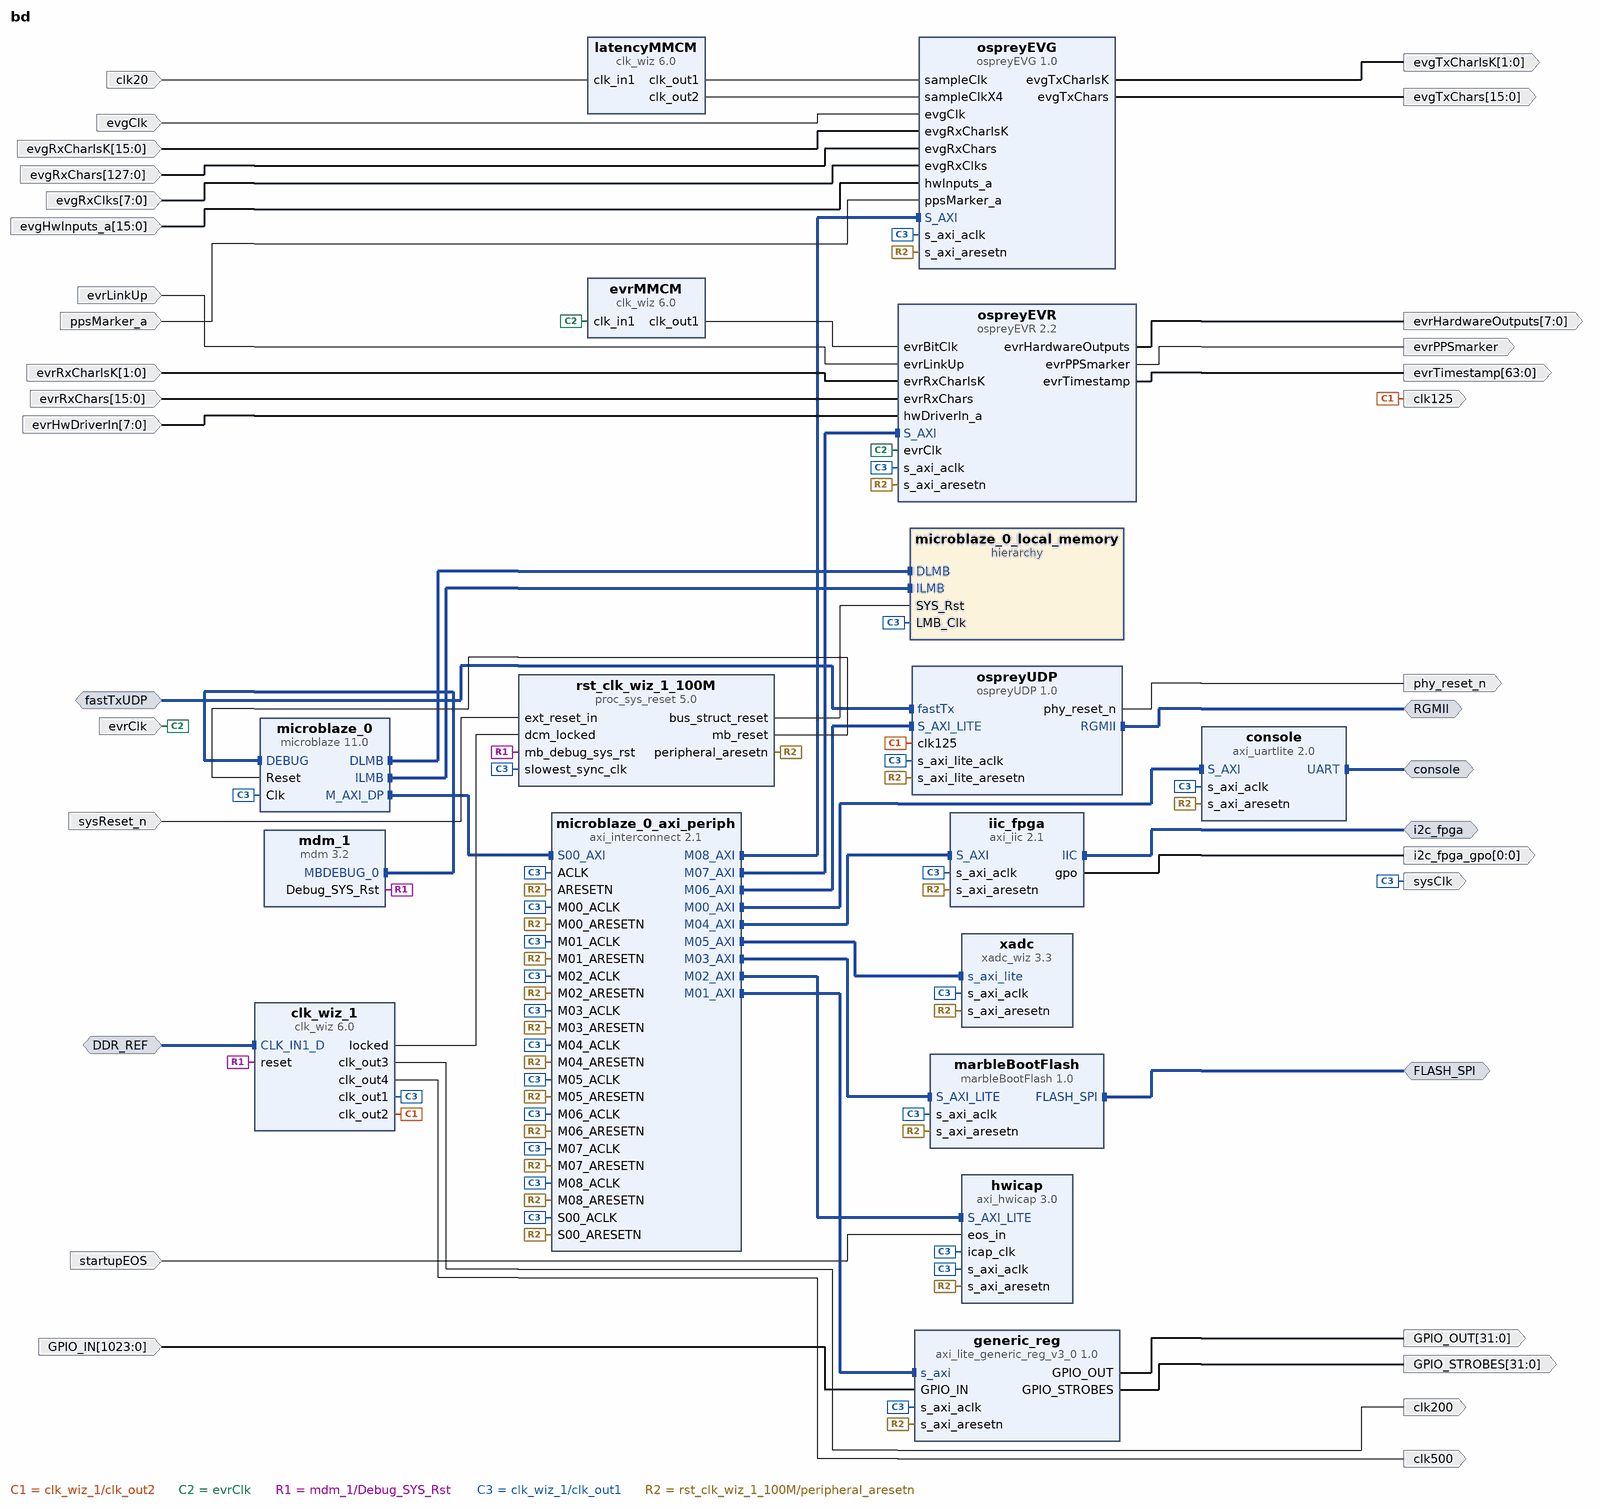
[diagram p0: block diagram of the top level]
# Vivado block design bd, xc7k160tffg676-2, Vivado 2023.1
create_bd_design bd

create_bd_intf_port -mode Slave -vlnv xilinx.com:interface:diff_clock_rtl:1.0 DDR_REF
set_property -dict {CONFIG.FREQ_HZ 125000000} [get_bd_intf_ports DDR_REF]
create_bd_intf_port -mode Master -vlnv xilinx.com:interface:uart_rtl:1.0 console
create_bd_intf_port -mode Master -vlnv OspreyDCS:user:FLASH_SPI_rtl:1.1 FLASH_SPI
create_bd_intf_port -mode Master -vlnv xilinx.com:interface:iic_rtl:1.0 i2c_fpga
create_bd_intf_port -mode Master -vlnv xilinx.com:interface:rgmii_rtl:1.0 RGMII
create_bd_intf_port -mode Slave -vlnv xilinx.com:interface:axis_rtl:1.0 fastTxUDP
set_property -dict [list \
  CONFIG.FREQ_HZ 125000000 \
  CONFIG.HAS_TKEEP 0 \
  CONFIG.HAS_TLAST 1 \
  CONFIG.HAS_TREADY 1 \
  CONFIG.HAS_TSTRB 0 \
  CONFIG.LAYERED_METADATA undef \
  CONFIG.TDATA_NUM_BYTES 1 \
  CONFIG.TDEST_WIDTH 0 \
  CONFIG.TID_WIDTH 0 \
  CONFIG.TUSER_WIDTH 0 \
] [get_bd_intf_ports fastTxUDP]
create_bd_port -dir I -type rst sysReset_n
set_property -dict {CONFIG.POLARITY ACTIVE_LOW} [get_bd_ports sysReset_n]
create_bd_port -dir I -from 1023 -to 0 GPIO_IN
create_bd_port -dir O -from 31 -to 0 GPIO_OUT
create_bd_port -dir O -from 31 -to 0 GPIO_STROBES
create_bd_port -dir O -type clk sysClk
create_bd_port -dir O -from 0 -to 0 i2c_fpga_gpo
create_bd_port -dir O phy_reset_n
create_bd_port -dir I evgClk
create_bd_port -dir I ppsMarker_a
create_bd_port -dir O -from 15 -to 0 evgTxChars
create_bd_port -dir O -from 1 -to 0 evgTxCharIsK
create_bd_port -dir I startupEOS
create_bd_port -dir O -type clk clk125
create_bd_port -dir O -type clk clk200
create_bd_port -dir O -type clk clk500
create_bd_port -dir I -from 7 -to 0 evgRxClks
create_bd_port -dir I -from 127 -to 0 evgRxChars
create_bd_port -dir I -from 15 -to 0 evgRxCharIsK
create_bd_port -dir I -type clk clk20
set_property -dict {CONFIG.FREQ_HZ 20000000} [get_bd_ports clk20]
create_bd_port -dir I -from 15 -to 0 evgHwInputs_a
create_bd_port -dir I evrClk
create_bd_port -dir I -from 15 -to 0 evrRxChars
create_bd_port -dir I -from 1 -to 0 evrRxCharIsK
create_bd_port -dir I evrLinkUp
create_bd_port -dir I -from 7 -to 0 evrHwDriverIn
create_bd_port -dir O evrPPSmarker
create_bd_port -dir O -from 7 -to 0 evrHardwareOutputs
create_bd_port -dir O -from 63 -to 0 evrTimestamp

create_bd_cell -type ip -vlnv xilinx.com:ip:microblaze:11.0 microblaze_0
set_property -dict [list \
  CONFIG.C_DEBUG_ENABLED 1 \
  CONFIG.C_D_AXI 1 \
  CONFIG.C_D_LMB 1 \
  CONFIG.C_I_LMB 1 \
  CONFIG.C_USE_BARREL 1 \
  CONFIG.C_USE_DIV 1 \
  CONFIG.C_USE_HW_MUL 1 \
] [get_bd_cells microblaze_0]
create_bd_cell -type hier microblaze_0_local_memory
create_bd_cell -type ip -vlnv xilinx.com:ip:mdm:3.2 mdm_1
create_bd_cell -type ip -vlnv xilinx.com:ip:clk_wiz:6.0 clk_wiz_1
set_property -dict [list \
  CONFIG.CLKIN1_JITTER_PS 80.0 \
  CONFIG.CLKOUT1_JITTER 124.615 \
  CONFIG.CLKOUT1_PHASE_ERROR 96.948 \
  CONFIG.CLKOUT2_JITTER 119.348 \
  CONFIG.CLKOUT2_PHASE_ERROR 96.948 \
  CONFIG.CLKOUT2_REQUESTED_OUT_FREQ 125 \
  CONFIG.CLKOUT2_USED true \
  CONFIG.CLKOUT3_JITTER 109.241 \
  CONFIG.CLKOUT3_PHASE_ERROR 96.948 \
  CONFIG.CLKOUT3_REQUESTED_OUT_FREQ 200 \
  CONFIG.CLKOUT3_USED true \
  CONFIG.CLKOUT4_JITTER 92.027 \
  CONFIG.CLKOUT4_PHASE_ERROR 96.948 \
  CONFIG.CLKOUT4_REQUESTED_OUT_FREQ 500 \
  CONFIG.CLKOUT4_REQUESTED_PHASE 180 \
  CONFIG.CLKOUT4_USED true \
  CONFIG.MMCM_CLKFBOUT_MULT_F 8.000 \
  CONFIG.MMCM_CLKIN1_PERIOD 8.000 \
  CONFIG.MMCM_CLKOUT1_DIVIDE 8 \
  CONFIG.MMCM_CLKOUT2_DIVIDE 5 \
  CONFIG.MMCM_CLKOUT3_DIVIDE 2 \
  CONFIG.MMCM_CLKOUT3_PHASE 180.000 \
  CONFIG.NUM_OUT_CLKS 4 \
  CONFIG.PRIM_SOURCE Differential_clock_capable_pin \
  CONFIG.USE_INCLK_STOPPED false \
] [get_bd_cells clk_wiz_1]
create_bd_cell -type ip -vlnv xilinx.com:ip:proc_sys_reset:5.0 rst_clk_wiz_1_100M
create_bd_cell -type ip -vlnv xilinx.com:ip:axi_uartlite:2.0 console
set_property -dict {CONFIG.C_BAUDRATE 115200} [get_bd_cells console]
create_bd_cell -type ip -vlnv xilinx.com:ip:axi_interconnect:2.1 microblaze_0_axi_periph
set_property -dict {CONFIG.NUM_MI 9} [get_bd_cells microblaze_0_axi_periph]
create_bd_cell -type ip -vlnv ospreydcs.com:user:axi_lite_generic_reg_v3_0:1.0 generic_reg
create_bd_cell -type ip -vlnv user.org:user:marbleBootFlash:1.0 marbleBootFlash
create_bd_cell -type ip -vlnv xilinx.com:ip:axi_iic:2.1 iic_fpga
set_property -dict {CONFIG.C_SCL_INERTIAL_DELAY 30 CONFIG.C_SDA_INERTIAL_DELAY 30} [get_bd_cells iic_fpga]
create_bd_cell -type ip -vlnv xilinx.com:ip:xadc_wiz:3.3 xadc
set_property -dict [list \
  CONFIG.AVERAGE_ENABLE_TEMPERATURE true \
  CONFIG.AVERAGE_ENABLE_VBRAM true \
  CONFIG.AVERAGE_ENABLE_VCCAUX true \
  CONFIG.AVERAGE_ENABLE_VCCINT true \
  CONFIG.CHANNEL_AVERAGING 64 \
  CONFIG.CHANNEL_ENABLE_CALIBRATION true \
  CONFIG.CHANNEL_ENABLE_TEMPERATURE true \
  CONFIG.CHANNEL_ENABLE_VBRAM true \
  CONFIG.CHANNEL_ENABLE_VCCAUX true \
  CONFIG.CHANNEL_ENABLE_VCCINT true \
  CONFIG.CHANNEL_ENABLE_VP_VN false \
  CONFIG.EXTERNAL_MUX_CHANNEL VP_VN \
  CONFIG.SEQUENCER_MODE Continuous \
  CONFIG.SINGLE_CHANNEL_SELECTION TEMPERATURE \
  CONFIG.XADC_STARUP_SELECTION channel_sequencer \
] [get_bd_cells xadc]
create_bd_cell -type ip -vlnv xilinx.com:ip:axi_hwicap:3.0 hwicap
create_bd_cell -type ip -vlnv user.org:user:ospreyUDP:1.0 ospreyUDP
create_bd_cell -type ip -vlnv xilinx.com:ip:clk_wiz:6.0 latencyMMCM
set_property -dict [list \
  CONFIG.CLKOUT1_JITTER 198.455 \
  CONFIG.CLKOUT1_PHASE_ERROR 309.974 \
  CONFIG.CLKOUT1_REQUESTED_OUT_FREQ 156.25 \
  CONFIG.CLKOUT2_JITTER 171.924 \
  CONFIG.CLKOUT2_PHASE_ERROR 309.974 \
  CONFIG.CLKOUT2_REQUESTED_OUT_FREQ 625 \
  CONFIG.CLKOUT2_USED true \
  CONFIG.MMCM_CLKFBOUT_MULT_F 62.500 \
  CONFIG.MMCM_CLKOUT0_DIVIDE_F 8.000 \
  CONFIG.MMCM_CLKOUT1_DIVIDE 2 \
  CONFIG.NUM_OUT_CLKS 2 \
  CONFIG.PRIM_SOURCE Global_buffer \
  CONFIG.USE_LOCKED false \
  CONFIG.USE_RESET false \
] [get_bd_cells latencyMMCM]
create_bd_cell -type ip -vlnv xilinx.com:ip:clk_wiz:6.0 evrMMCM
set_property -dict [list \
  CONFIG.CLKIN1_JITTER_PS 80.0 \
  CONFIG.CLKOUT1_JITTER 92.027 \
  CONFIG.CLKOUT1_PHASE_ERROR 96.948 \
  CONFIG.CLKOUT1_REQUESTED_OUT_FREQ 500 \
  CONFIG.MMCM_CLKFBOUT_MULT_F 8.000 \
  CONFIG.MMCM_CLKIN1_PERIOD 8.000 \
  CONFIG.MMCM_CLKOUT0_DIVIDE_F 2.000 \
  CONFIG.PRIM_IN_FREQ 125 \
  CONFIG.USE_LOCKED false \
  CONFIG.USE_RESET false \
] [get_bd_cells evrMMCM]
create_bd_cell -type ip -vlnv ospreydcs.com:user:ospreyEVG:1.0 ospreyEVG
set_property -dict [list \
  CONFIG.DEBUG false \
  CONFIG.EVGCLK_FREQUENCY 125000000 \
  CONFIG.INPUT_COUNT 16 \
  CONFIG.RX_COUNT 8 \
  CONFIG.SEQRAM_ADDR_WIDTH 12 \
  CONFIG.SEQRAM_BANK_COUNT 8 \
  CONFIG.TIMER_COUNT 8 \
] [get_bd_cells ospreyEVG]
create_bd_cell -type ip -vlnv ospreydcs.com:osprey:ospreyEVR:2.2 ospreyEVR
set_property -dict [list \
  CONFIG.ACTIVE_LOW_OUTPUTS true \
  CONFIG.DEBUG false \
  CONFIG.HARDWARE_OUTPUT_COUNT 8 \
  CONFIG.SERDES_FACTOR 1 \
] [get_bd_cells ospreyEVR]

# ---- hierarchy /microblaze_0_local_memory ----
current_bd_instance /microblaze_0_local_memory
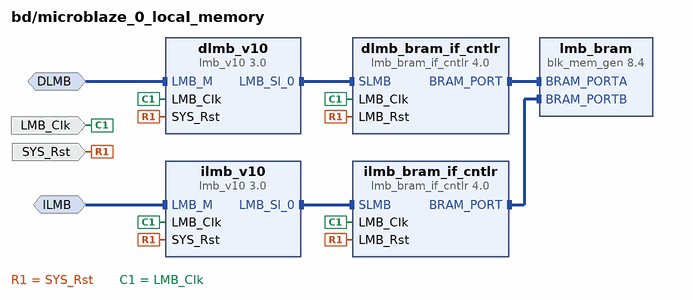
[diagram p1: block diagram inside /microblaze_0_local_memory]
create_bd_intf_pin -mode MirroredMaster -vlnv xilinx.com:interface:lmb_rtl:1.0 DLMB
create_bd_intf_pin -mode MirroredMaster -vlnv xilinx.com:interface:lmb_rtl:1.0 ILMB
create_bd_pin -dir I -type clk LMB_Clk
create_bd_pin -dir I -type rst SYS_Rst

create_bd_cell -type ip -vlnv xilinx.com:ip:lmb_v10:3.0 dlmb_v10
create_bd_cell -type ip -vlnv xilinx.com:ip:lmb_v10:3.0 ilmb_v10
create_bd_cell -type ip -vlnv xilinx.com:ip:lmb_bram_if_cntlr:4.0 dlmb_bram_if_cntlr
set_property -dict {CONFIG.C_ECC 0} [get_bd_cells dlmb_bram_if_cntlr]
create_bd_cell -type ip -vlnv xilinx.com:ip:lmb_bram_if_cntlr:4.0 ilmb_bram_if_cntlr
set_property -dict {CONFIG.C_ECC 0} [get_bd_cells ilmb_bram_if_cntlr]
create_bd_cell -type ip -vlnv xilinx.com:ip:blk_mem_gen:8.4 lmb_bram
set_property -dict {CONFIG.Memory_Type True_Dual_Port_RAM CONFIG.use_bram_block BRAM_Controller} [get_bd_cells lmb_bram]

# ---- connections ----

current_bd_instance /microblaze_0_local_memory
connect_bd_intf_net -intf_net microblaze_0_dlmb [get_bd_intf_pins dlmb_v10/LMB_M] [get_bd_intf_pins DLMB]
connect_bd_intf_net -intf_net microblaze_0_dlmb_bus [get_bd_intf_pins dlmb_v10/LMB_Sl_0] [get_bd_intf_pins dlmb_bram_if_cntlr/SLMB]
connect_bd_intf_net -intf_net microblaze_0_dlmb_cntlr [get_bd_intf_pins dlmb_bram_if_cntlr/BRAM_PORT] [get_bd_intf_pins lmb_bram/BRAM_PORTA]
connect_bd_intf_net -intf_net microblaze_0_ilmb [get_bd_intf_pins ilmb_v10/LMB_M] [get_bd_intf_pins ILMB]
connect_bd_intf_net -intf_net microblaze_0_ilmb_bus [get_bd_intf_pins ilmb_v10/LMB_Sl_0] [get_bd_intf_pins ilmb_bram_if_cntlr/SLMB]
connect_bd_intf_net -intf_net microblaze_0_ilmb_cntlr [get_bd_intf_pins ilmb_bram_if_cntlr/BRAM_PORT] [get_bd_intf_pins lmb_bram/BRAM_PORTB]
connect_bd_net [get_bd_pins SYS_Rst] \
  [get_bd_pins dlmb_v10/SYS_Rst] [get_bd_pins dlmb_bram_if_cntlr/LMB_Rst] [get_bd_pins ilmb_v10/SYS_Rst] \
  [get_bd_pins ilmb_bram_if_cntlr/LMB_Rst]
connect_bd_net -net microblaze_0_Clk [get_bd_pins LMB_Clk] \
  [get_bd_pins dlmb_v10/LMB_Clk] [get_bd_pins dlmb_bram_if_cntlr/LMB_Clk] [get_bd_pins ilmb_v10/LMB_Clk] \
  [get_bd_pins ilmb_bram_if_cntlr/LMB_Clk]
set_property HDL_ATTRIBUTE.BMM_INFO_ADDRESS_SPACE {byte  0x00000000 32 > bd microblaze_0_local_memory/lmb_bram} [get_bd_cells dlmb_bram_if_cntlr]
set_property HDL_ATTRIBUTE.KEEP_HIERARCHY yes [get_bd_cells dlmb_bram_if_cntlr]

current_bd_instance /
connect_bd_intf_net -intf_net axi_iic_0_IIC [get_bd_intf_ports i2c_fpga] [get_bd_intf_pins iic_fpga/IIC]
connect_bd_intf_net -intf_net axi_uartlite_0_UART [get_bd_intf_ports console] [get_bd_intf_pins console/UART]
connect_bd_intf_net -intf_net diff_clock_rtl_0_1 [get_bd_intf_ports DDR_REF] [get_bd_intf_pins clk_wiz_1/CLK_IN1_D]
connect_bd_intf_net -intf_net fastTx_0_1 [get_bd_intf_ports fastTxUDP] [get_bd_intf_pins ospreyUDP/fastTx]
connect_bd_intf_net -intf_net marbleBootFlash_0_FLASH_SPI [get_bd_intf_ports FLASH_SPI] [get_bd_intf_pins marbleBootFlash/FLASH_SPI]
connect_bd_intf_net [get_bd_intf_pins microblaze_0/M_AXI_DP] [get_bd_intf_pins microblaze_0_axi_periph/S00_AXI]
connect_bd_intf_net [get_bd_intf_pins microblaze_0_axi_periph/M00_AXI] [get_bd_intf_pins console/S_AXI]
connect_bd_intf_net [get_bd_intf_pins microblaze_0_axi_periph/M01_AXI] [get_bd_intf_pins generic_reg/s_axi]
connect_bd_intf_net [get_bd_intf_pins microblaze_0_axi_periph/M02_AXI] [get_bd_intf_pins hwicap/S_AXI_LITE]
connect_bd_intf_net [get_bd_intf_pins microblaze_0_axi_periph/M03_AXI] [get_bd_intf_pins marbleBootFlash/S_AXI_LITE]
connect_bd_intf_net [get_bd_intf_pins microblaze_0_axi_periph/M04_AXI] [get_bd_intf_pins iic_fpga/S_AXI]
connect_bd_intf_net [get_bd_intf_pins microblaze_0_axi_periph/M05_AXI] [get_bd_intf_pins xadc/s_axi_lite]
connect_bd_intf_net [get_bd_intf_pins microblaze_0_axi_periph/M06_AXI] [get_bd_intf_pins ospreyUDP/S_AXI_LITE]
connect_bd_intf_net [get_bd_intf_pins microblaze_0_axi_periph/M07_AXI] [get_bd_intf_pins ospreyEVR/S_AXI]
connect_bd_intf_net [get_bd_intf_pins microblaze_0_axi_periph/M08_AXI] [get_bd_intf_pins ospreyEVG/S_AXI]
connect_bd_intf_net [get_bd_intf_pins mdm_1/MBDEBUG_0] [get_bd_intf_pins microblaze_0/DEBUG]
connect_bd_intf_net [get_bd_intf_pins microblaze_0/DLMB] [get_bd_intf_pins microblaze_0_local_memory/DLMB]
connect_bd_intf_net [get_bd_intf_pins microblaze_0/ILMB] [get_bd_intf_pins microblaze_0_local_memory/ILMB]
connect_bd_intf_net -intf_net ospreyUDP_0_RGMII [get_bd_intf_ports RGMII] [get_bd_intf_pins ospreyUDP/RGMII]
connect_bd_net -net GPIO_IN_0_1 [get_bd_ports GPIO_IN] [get_bd_pins generic_reg/GPIO_IN]
connect_bd_net -net axi_lite_generic_reg_0_GPIO_OUT [get_bd_pins generic_reg/GPIO_OUT] [get_bd_ports GPIO_OUT]
connect_bd_net -net axi_lite_generic_reg_0_GPIO_STROBES [get_bd_pins generic_reg/GPIO_STROBES] [get_bd_ports GPIO_STROBES]
connect_bd_net -net clk_in1_0_1 [get_bd_ports clk20] [get_bd_pins latencyMMCM/clk_in1]
connect_bd_net -net clk_wiz_0_clk_out1 [get_bd_pins evrMMCM/clk_out1] [get_bd_pins ospreyEVR/evrBitClk]
connect_bd_net [get_bd_pins clk_wiz_1/clk_out2] [get_bd_ports clk125] [get_bd_pins ospreyUDP/clk125]
connect_bd_net [get_bd_pins clk_wiz_1/clk_out3] [get_bd_ports clk200]
connect_bd_net [get_bd_pins clk_wiz_1/clk_out4] [get_bd_ports clk500]
connect_bd_net [get_bd_pins clk_wiz_1/locked] [get_bd_pins rst_clk_wiz_1_100M/dcm_locked]
connect_bd_net -net eos_in_0_1 [get_bd_ports startupEOS] [get_bd_pins hwicap/eos_in]
connect_bd_net [get_bd_ports evgClk] [get_bd_pins ospreyEVG/evgClk]
connect_bd_net -net evgRxCharIsK_0_1 [get_bd_ports evgRxCharIsK] [get_bd_pins ospreyEVG/evgRxCharIsK]
connect_bd_net -net evgRxChars_0_1 [get_bd_ports evgRxChars] [get_bd_pins ospreyEVG/evgRxChars]
connect_bd_net -net evgRxClks_0_1 [get_bd_ports evgRxClks] [get_bd_pins ospreyEVG/evgRxClks]
connect_bd_net -net evrClk_0_1 [get_bd_ports evrClk] [get_bd_pins evrMMCM/clk_in1] [get_bd_pins ospreyEVR/evrClk]
connect_bd_net -net evrLinkUp_0_1 [get_bd_ports evrLinkUp] [get_bd_pins ospreyEVR/evrLinkUp]
connect_bd_net -net evrRxCharIsK_0_1 [get_bd_ports evrRxCharIsK] [get_bd_pins ospreyEVR/evrRxCharIsK]
connect_bd_net -net evrRxChars_0_1 [get_bd_ports evrRxChars] [get_bd_pins ospreyEVR/evrRxChars]
connect_bd_net -net hwDriverIn_a_0_1 [get_bd_ports evrHwDriverIn] [get_bd_pins ospreyEVR/hwDriverIn_a]
connect_bd_net -net hwInputs_a_0_1 [get_bd_ports evgHwInputs_a] [get_bd_pins ospreyEVG/hwInputs_a]
connect_bd_net [get_bd_pins iic_fpga/gpo] [get_bd_ports i2c_fpga_gpo]
connect_bd_net [get_bd_pins latencyMMCM/clk_out1] [get_bd_pins ospreyEVG/sampleClk]
connect_bd_net [get_bd_pins latencyMMCM/clk_out2] [get_bd_pins ospreyEVG/sampleClkX4]
connect_bd_net [get_bd_pins mdm_1/Debug_SYS_Rst] [get_bd_pins rst_clk_wiz_1_100M/mb_debug_sys_rst] [get_bd_pins clk_wiz_1/reset]
connect_bd_net -net microblaze_0_Clk [get_bd_pins clk_wiz_1/clk_out1] \
  [get_bd_pins microblaze_0/Clk] [get_bd_pins microblaze_0_local_memory/LMB_Clk] \
  [get_bd_pins rst_clk_wiz_1_100M/slowest_sync_clk] [get_bd_pins microblaze_0_axi_periph/S00_ACLK] \
  [get_bd_pins console/s_axi_aclk] [get_bd_pins microblaze_0_axi_periph/M00_ACLK] [get_bd_pins microblaze_0_axi_periph/ACLK] \
  [get_bd_pins microblaze_0_axi_periph/M01_ACLK] [get_bd_ports sysClk] [get_bd_pins microblaze_0_axi_periph/M02_ACLK] \
  [get_bd_pins generic_reg/s_axi_aclk] [get_bd_pins marbleBootFlash/s_axi_aclk] \
  [get_bd_pins microblaze_0_axi_periph/M03_ACLK] [get_bd_pins iic_fpga/s_axi_aclk] \
  [get_bd_pins microblaze_0_axi_periph/M04_ACLK] [get_bd_pins xadc/s_axi_aclk] [get_bd_pins microblaze_0_axi_periph/M05_ACLK] \
  [get_bd_pins microblaze_0_axi_periph/M06_ACLK] [get_bd_pins microblaze_0_axi_periph/M07_ACLK] \
  [get_bd_pins microblaze_0_axi_periph/M08_ACLK] [get_bd_pins hwicap/s_axi_aclk] [get_bd_pins hwicap/icap_clk] \
  [get_bd_pins ospreyUDP/s_axi_lite_aclk] [get_bd_pins ospreyEVG/s_axi_aclk] [get_bd_pins ospreyEVR/s_axi_aclk]
connect_bd_net -net ospreyEVG_0_evgTxCharIsK [get_bd_pins ospreyEVG/evgTxCharIsK] [get_bd_ports evgTxCharIsK]
connect_bd_net -net ospreyEVG_0_evgTxChars [get_bd_pins ospreyEVG/evgTxChars] [get_bd_ports evgTxChars]
connect_bd_net [get_bd_pins ospreyEVR/evrHardwareOutputs] [get_bd_ports evrHardwareOutputs]
connect_bd_net [get_bd_pins ospreyEVR/evrPPSmarker] [get_bd_ports evrPPSmarker]
connect_bd_net [get_bd_pins ospreyEVR/evrTimestamp] [get_bd_ports evrTimestamp]
connect_bd_net -net ospreyUDP_0_phy_reset_n [get_bd_pins ospreyUDP/phy_reset_n] [get_bd_ports phy_reset_n]
connect_bd_net [get_bd_ports ppsMarker_a] [get_bd_pins ospreyEVG/ppsMarker_a]
connect_bd_net -net reset_rtl_0_1 [get_bd_ports sysReset_n] [get_bd_pins rst_clk_wiz_1_100M/ext_reset_in]
connect_bd_net [get_bd_pins rst_clk_wiz_1_100M/bus_struct_reset] [get_bd_pins microblaze_0_local_memory/SYS_Rst]
connect_bd_net [get_bd_pins rst_clk_wiz_1_100M/mb_reset] [get_bd_pins microblaze_0/Reset]
connect_bd_net [get_bd_pins rst_clk_wiz_1_100M/peripheral_aresetn] \
  [get_bd_pins microblaze_0_axi_periph/S00_ARESETN] [get_bd_pins console/s_axi_aresetn] \
  [get_bd_pins microblaze_0_axi_periph/M00_ARESETN] [get_bd_pins microblaze_0_axi_periph/ARESETN] \
  [get_bd_pins microblaze_0_axi_periph/M01_ARESETN] [get_bd_pins microblaze_0_axi_periph/M02_ARESETN] \
  [get_bd_pins generic_reg/s_axi_aresetn] [get_bd_pins marbleBootFlash/s_axi_aresetn] \
  [get_bd_pins microblaze_0_axi_periph/M03_ARESETN] [get_bd_pins iic_fpga/s_axi_aresetn] \
  [get_bd_pins microblaze_0_axi_periph/M04_ARESETN] [get_bd_pins xadc/s_axi_aresetn] \
  [get_bd_pins microblaze_0_axi_periph/M05_ARESETN] [get_bd_pins microblaze_0_axi_periph/M06_ARESETN] \
  [get_bd_pins microblaze_0_axi_periph/M07_ARESETN] [get_bd_pins microblaze_0_axi_periph/M08_ARESETN] \
  [get_bd_pins hwicap/s_axi_aresetn] [get_bd_pins ospreyUDP/s_axi_lite_aresetn] [get_bd_pins ospreyEVG/s_axi_aresetn] \
  [get_bd_pins ospreyEVR/s_axi_aresetn]
set_property HDL_ATTRIBUTE.BMM_INFO_PROCESSOR {microblaze-le > bd microblaze_0_local_memory/dlmb_bram_if_cntlr} [get_bd_cells microblaze_0]
set_property HDL_ATTRIBUTE.KEEP_HIERARCHY yes [get_bd_cells microblaze_0]

# ---- address map ----
assign_bd_address -offset 0x00000000 -range 128K -target_address_space [get_bd_addr_spaces microblaze_0/Data] [get_bd_addr_segs microblaze_0_local_memory/dlmb_bram_if_cntlr/SLMB/Mem]
assign_bd_address -offset 0x40200000 -range 64K -target_address_space [get_bd_addr_spaces microblaze_0/Data] [get_bd_addr_segs hwicap/S_AXI_LITE/Reg]
assign_bd_address -offset 0x40600000 -range 64K -target_address_space [get_bd_addr_spaces microblaze_0/Data] [get_bd_addr_segs console/S_AXI/Reg]
assign_bd_address -offset 0x40800000 -range 64K -target_address_space [get_bd_addr_spaces microblaze_0/Data] [get_bd_addr_segs iic_fpga/S_AXI/Reg]
assign_bd_address -offset 0x44A00000 -range 64K -target_address_space [get_bd_addr_spaces microblaze_0/Data] [get_bd_addr_segs generic_reg/s_axi/reg0]
assign_bd_address -offset 0x44A10000 -range 64K -target_address_space [get_bd_addr_spaces microblaze_0/Data] [get_bd_addr_segs ospreyEVR/S_AXI/S_AXI_reg]
assign_bd_address -offset 0x44A20000 -range 64K -target_address_space [get_bd_addr_spaces microblaze_0/Data] [get_bd_addr_segs marbleBootFlash/S_AXI_LITE/S_AXI_LITE_reg]
assign_bd_address -offset 0x44A30000 -range 64K -target_address_space [get_bd_addr_spaces microblaze_0/Data] [get_bd_addr_segs xadc/s_axi_lite/Reg]
assign_bd_address -offset 0x44A40000 -range 64K -target_address_space [get_bd_addr_spaces microblaze_0/Data] [get_bd_addr_segs ospreyUDP/S_AXI_LITE/S_AXI_LITE_reg]
assign_bd_address -offset 0x44A50000 -range 64K -target_address_space [get_bd_addr_spaces microblaze_0/Data] [get_bd_addr_segs ospreyEVG/S_AXI/S_AXI_reg]
assign_bd_address -offset 0x00000000 -range 128K -target_address_space [get_bd_addr_spaces microblaze_0/Instruction] [get_bd_addr_segs microblaze_0_local_memory/ilmb_bram_if_cntlr/SLMB/Mem]

validate_bd_design
save_bd_design
